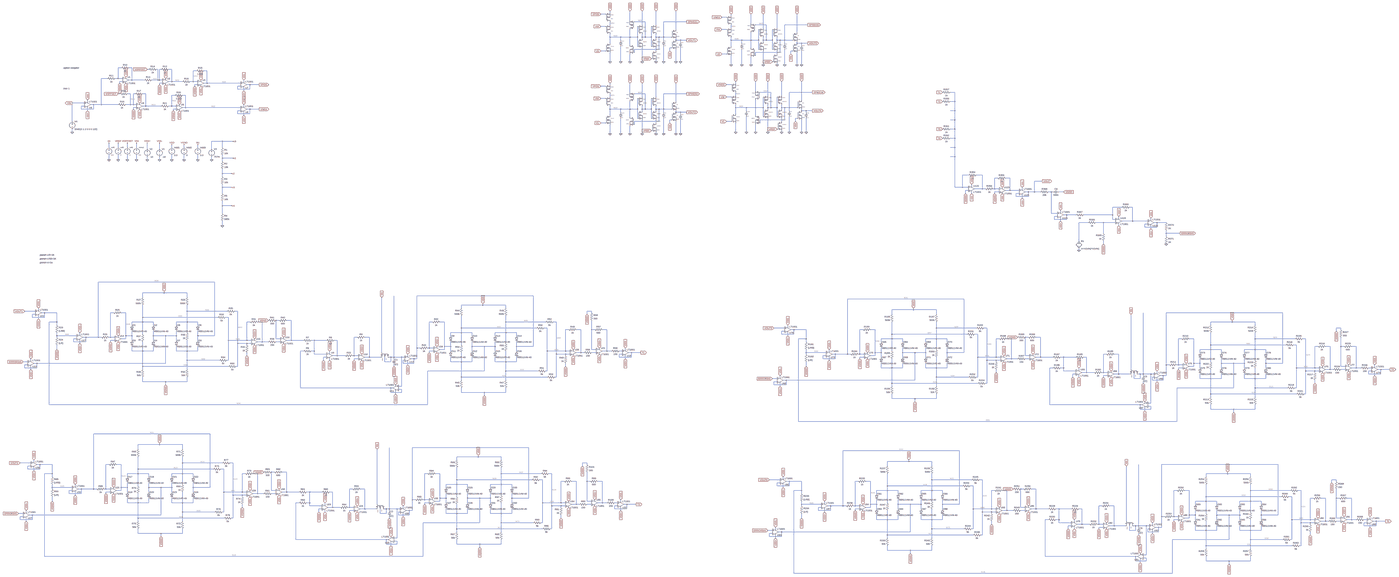
[diagram p0: schematic OZ_4_bounded_curves.asc, whole sheet]
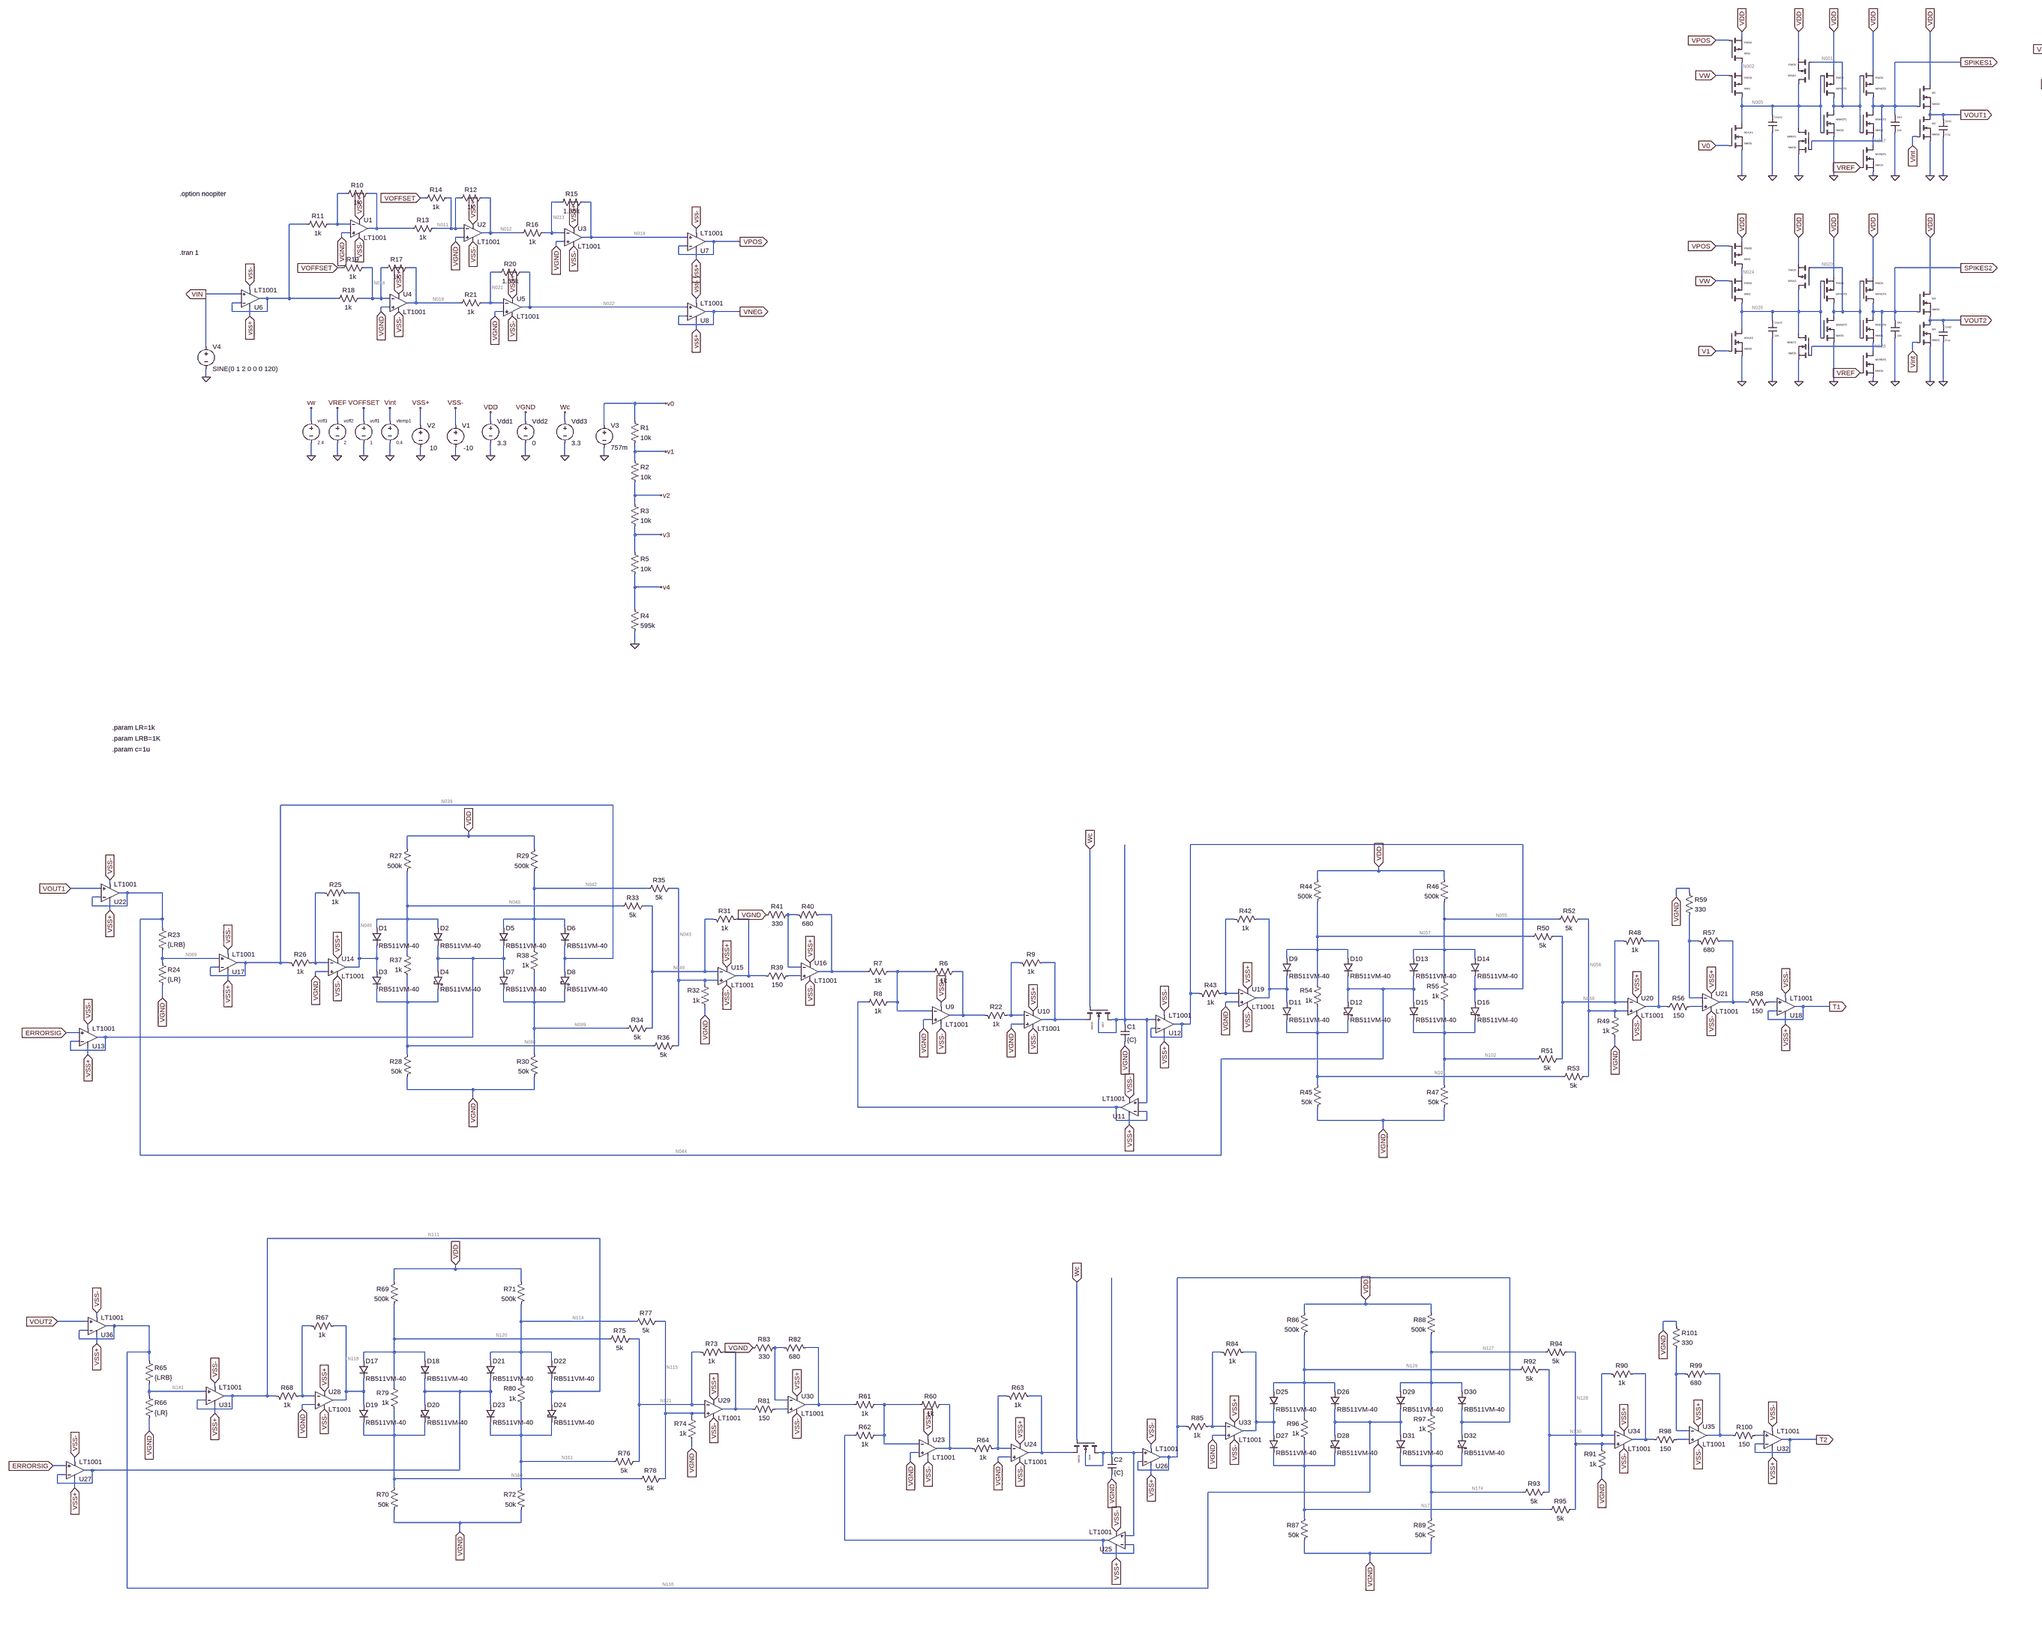
[diagram p1: schematic OZ_4_bounded_curves.asc, part, row 1 of 1, column 1 of 2]
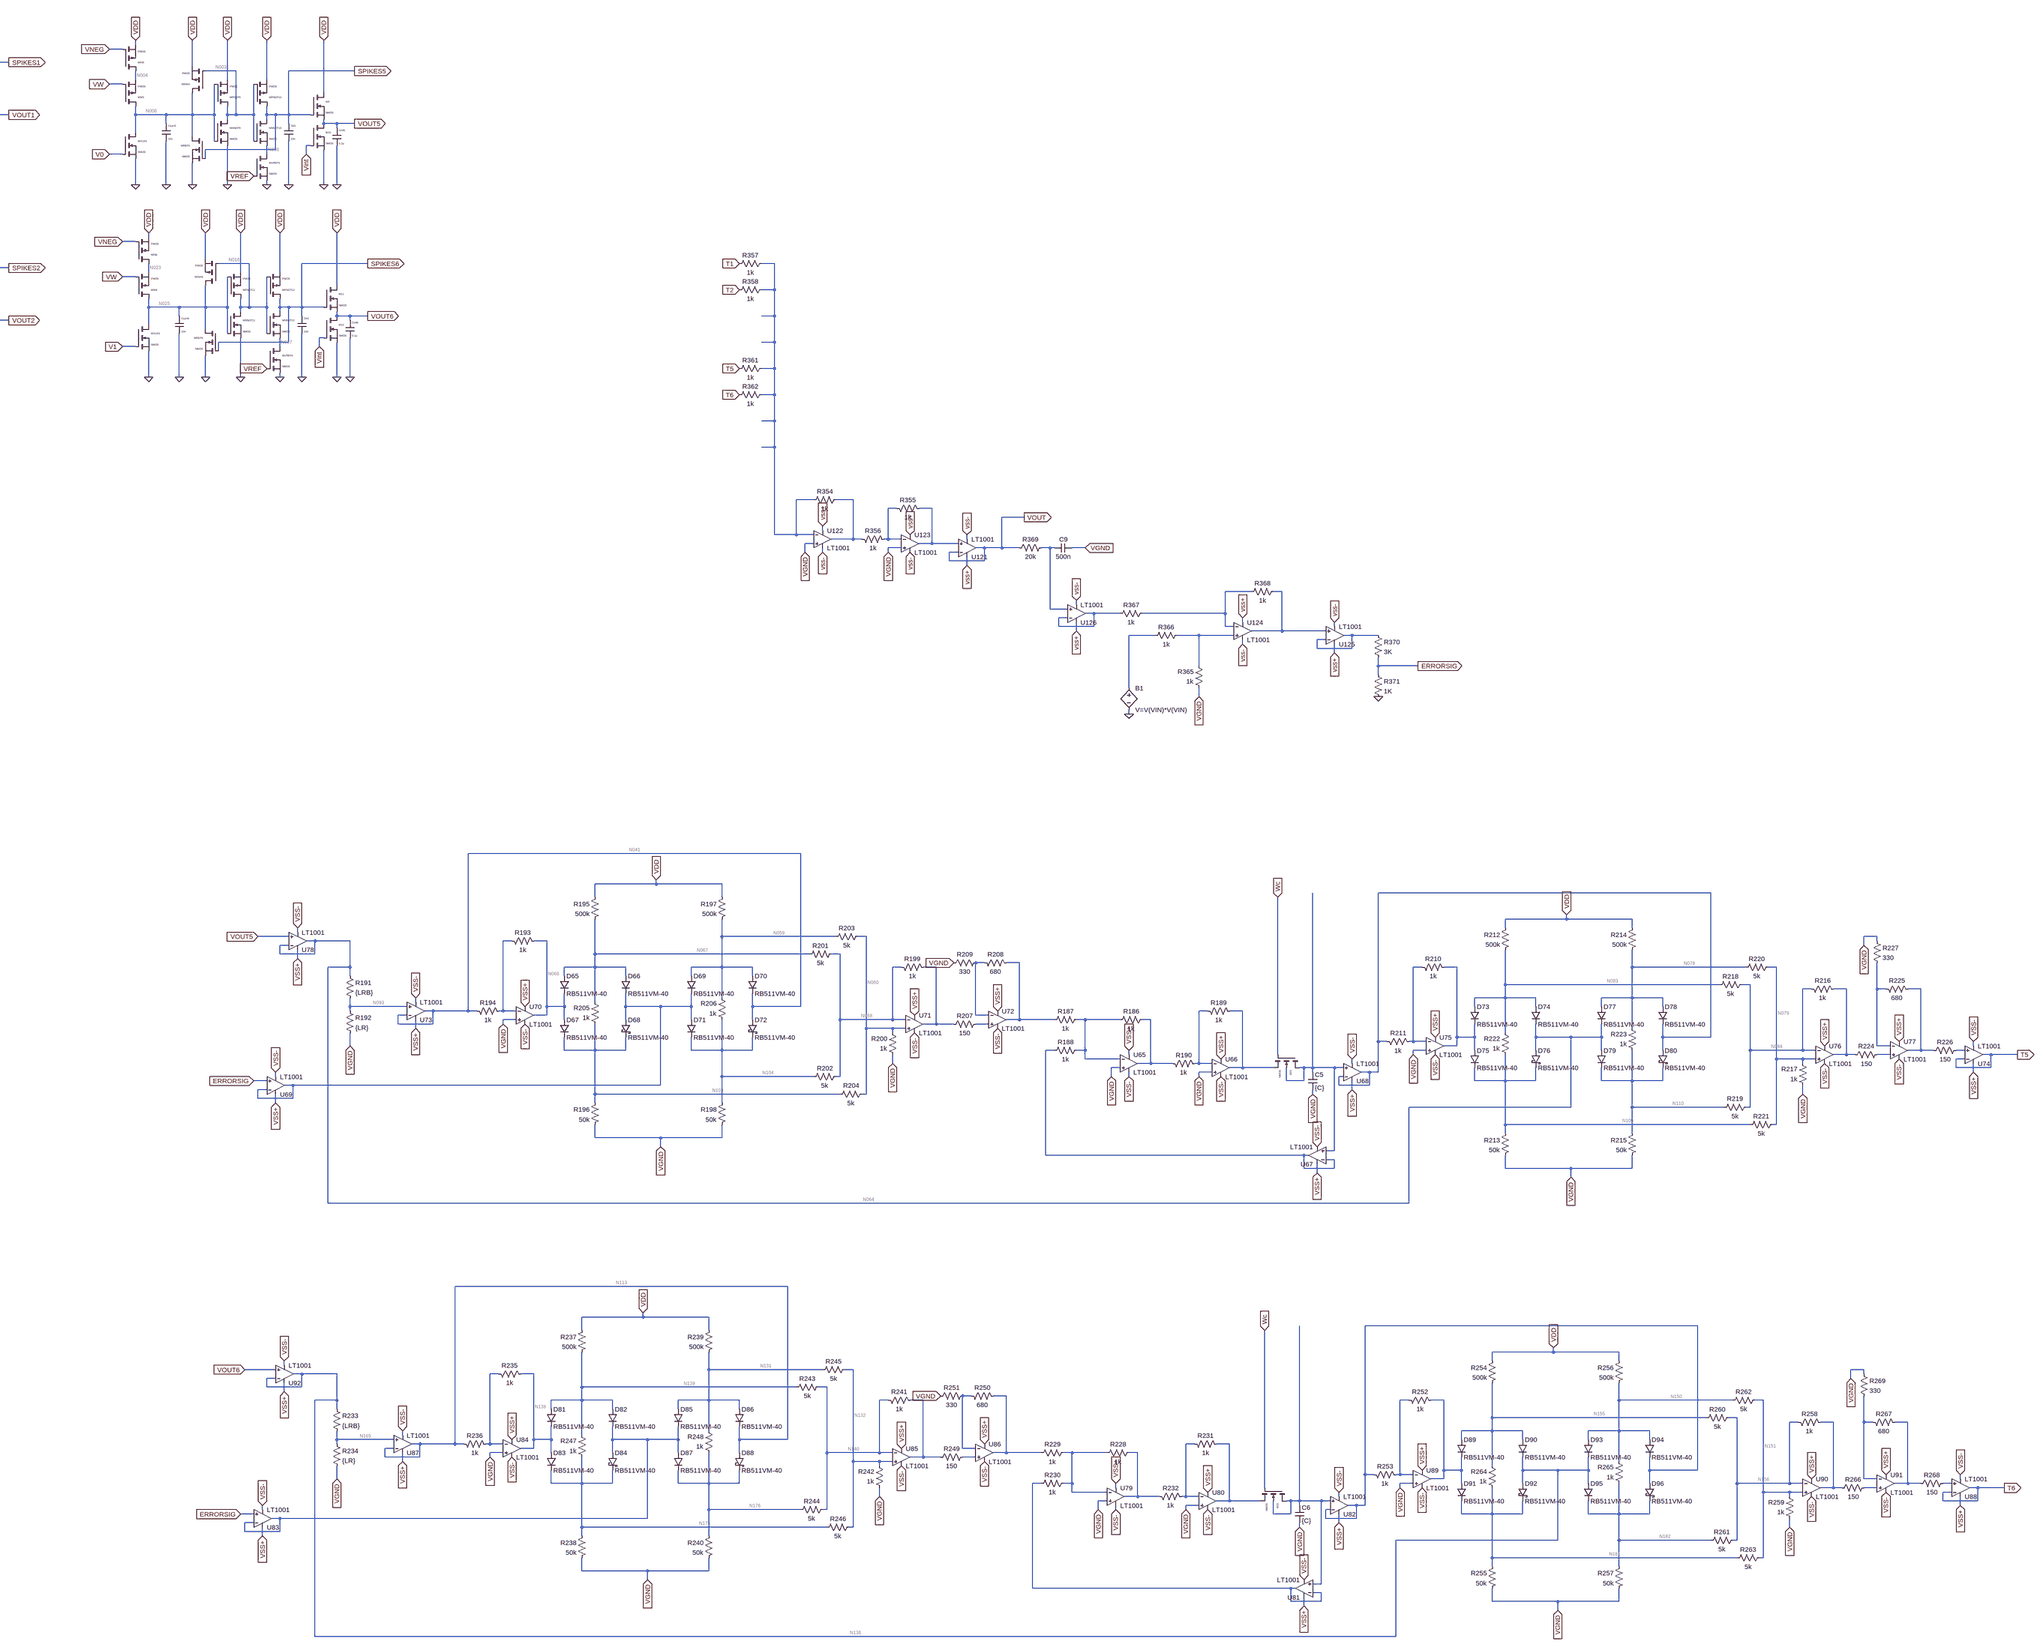
[diagram p2: schematic OZ_4_bounded_curves.asc, part, row 1 of 1, column 2 of 2]
* OZ_4_bounded_curves.asc
vtemp1 Vint 0 0.4
Vdd1 VDD 0 3.3
V1 VSS- 0 -10
V2 VSS+ 0 10
voff1 VOFFSET 0 1
voff2 VREF 0 2
voff3 vw 0 2.4
Vdd2 VGND 0 0
XU1 VGND N009 VSS+ VSS- N010 LT1001  ; pins In+ In- V+ V- OUT
R10 N010 N009 1k
R11 N009 N015 1k
XU2 VGND N011 VSS+ VSS- N012 LT1001  ; pins In+ In- V+ V- OUT
R12 N012 N011 1k
R13 N011 N010 1k
R14 N011 VOFFSET 1k
XU3 VGND N013 VSS+ VSS- N014 LT1001  ; pins In+ In- V+ V- OUT
R15 N014 N013 1.65k
R16 N013 N012 1k
XU4 VGND N018 VSS+ VSS- N019 LT1001  ; pins In+ In- V+ V- OUT
R17 N019 N018 1k
R18 N018 N015 1k
R19 N018 VOFFSET 1k
XU5 VGND N021 VSS+ VSS- N022 LT1001  ; pins In+ In- V+ V- OUT
R20 N022 N021 1.65k
R21 N021 N019 1k
XU6 VIN N015 VSS+ VSS- N015 LT1001  ; pins In+ In- V+ V- OUT
XU7 N014 VPOS VSS+ VSS- VPOS LT1001  ; pins In+ In- V+ V- OUT
XU8 N022 VNEG VSS+ VSS- VNEG LT1001  ; pins In+ In- V+ V- OUT
MW1 N005 vw N002 N002 PMOS
Csyn1 N005 0 10n V=4 Irms=162m Rser=0.395426 Lser=0 mfg="KEMET" pn="C0402C103K7PAC" type="X5R" IC=0
Ck1 SPIKES1 0 10n
MPNOT1 N001 N005 VDD VDD PMOS
MNNOT1 N001 N005 0 0 NMOS
MVREF1 N007 VREF 0 0 NMOS
MREF1 N005 SPIKES1 0 0 NMOS
MVLK1 N005 V0 0 0 NMOS
MINA1 N005 N001 VDD VDD PMOS
MIN1 N002 VPOS VDD VDD PMOS
MPNOT2 SPIKES1 N001 VDD VDD PMOS
MNNOT2 SPIKES1 N001 N007 N007 NMOS
M1 VDD SPIKES1 VOUT1 VOUT1 NMOS
M2 VOUT1 Vint 0 0 NMOS
Cint1 VOUT1 0 0.1µ
MW2 N026 vw N024 N024 PMOS
Csyn2 N026 0 10n V=4 Irms=162m Rser=0.395426 Lser=0 mfg="KEMET" pn="C0402C103K7PAC" type="X5R" IC=0
Ck2 SPIKES2 0 10n
MPNOT3 N020 N026 VDD VDD PMOS
MNNOT3 N020 N026 0 0 NMOS
MVREF2 N028 VREF 0 0 NMOS
MREF2 N026 SPIKES2 0 0 NMOS
MVLK2 N026 V1 0 0 NMOS
MINA2 N026 N020 VDD VDD PMOS
MIN2 N024 VPOS VDD VDD PMOS
MPNOT4 SPIKES2 N020 VDD VDD PMOS
MNNOT4 SPIKES2 N020 N028 N028 NMOS
M3 VDD SPIKES2 VOUT2 VOUT2 NMOS
M4 VOUT2 Vint 0 0 NMOS
Cint2 VOUT2 0 0.1µ
MW5 N006 vw N004 N004 PMOS
Csyn5 N006 0 10n V=4 Irms=162m Rser=0.395426 Lser=0 mfg="KEMET" pn="C0402C103K7PAC" type="X5R" IC=0
Ck5 SPIKES5 0 10n
MPNOT9 N003 N006 VDD VDD PMOS
MNNOT9 N003 N006 0 0 NMOS
MVREF5 N008 VREF 0 0 NMOS
MREF5 N006 SPIKES5 0 0 NMOS
MVLK5 N006 V0 0 0 NMOS
MINA5 N006 N003 VDD VDD PMOS
MIN5 N004 VNEG VDD VDD PMOS
MPNOT10 SPIKES5 N003 VDD VDD PMOS
MNNOT10 SPIKES5 N003 N008 N008 NMOS
M9 VDD SPIKES5 VOUT5 VOUT5 NMOS
M10 VOUT5 Vint 0 0 NMOS
Cint5 VOUT5 0 0.1µ
MW6 N025 vw N023 N023 PMOS
Csyn6 N025 0 10n V=4 Irms=162m Rser=0.395426 Lser=0 mfg="KEMET" pn="C0402C103K7PAC" type="X5R" IC=0
Ck6 SPIKES6 0 10n
MPNOT11 N016 N025 VDD VDD PMOS
MNNOT11 N016 N025 0 0 NMOS
MVREF6 N027 VREF 0 0 NMOS
MREF6 N025 SPIKES6 0 0 NMOS
MVLK6 N025 V1 0 0 NMOS
MINA6 N025 N016 VDD VDD PMOS
MIN6 N023 VNEG VDD VDD PMOS
MPNOT12 SPIKES6 N016 VDD VDD PMOS
MNNOT12 SPIKES6 N016 N027 N027 NMOS
M11 VDD SPIKES6 VOUT6 VOUT6 NMOS
M12 VOUT6 Vint 0 0 NMOS
Cint6 VOUT6 0 0.1µ
V3 V0 0 757m
R1 V0 V1 10k
R2 V1 v2 10k
R3 v2 v3 10k
R4 v4 0 595k
R5 v3 v4 10k
V4 VIN 0 SINE(0 1 2 0 0 0 120)
XU121 N031 VOUT VSS+ VSS- VOUT LT1001  ; pins In+ In- V+ V- OUT
XU122 VGND N017 VSS+ VSS- N029 LT1001  ; pins In+ In- V+ V- OUT
R354 N029 N017 1k
XU123 VGND N030 VSS+ VSS- N031 LT1001  ; pins In+ In- V+ V- OUT
R355 N030 N031 1k
R356 N029 N030 1k
R357 N017 T1 1k
R358 N017 T2 1k
R361 N017 T5 1k
R362 N017 T6 1k
M17 N097 Wc N072 N097 NMOS
C1 N097 VGND {C} IC=0
XU9 VGND N080 VSS+ VSS- N081 LT1001  ; pins In+ In- V+ V- OUT
R6 N081 N080 1k
R7 N080 N051 1k
R8 N080 N090 1k
XU10 VGND N071 VSS+ VSS- N072 LT1001  ; pins In+ In- V+ V- OUT
R9 N071 N072 1k
R22 N081 N071 1k
XU11 N097 N090 VSS+ VSS- N090 LT1001  ; pins In+ In- V+ V- OUT
XU12 N097 N040 VSS+ VSS- N040 LT1001  ; pins In+ In- V+ V- OUT
R23 N044 N069 {LRB}
R24 N069 VGND {LR}
XU13 ERRORSIG N070 VSS+ VSS- N070 LT1001  ; pins In+ In- V+ V- OUT
D1 N048 N046 RB511VM-40
XU14 VGND N045 VSS+ VSS- N046 LT1001  ; pins In+ In- V+ V- OUT
R25 N045 N046 1k
R26 N039 N045 1k
D2 N048 N070 RB511VM-40
D3 N046 N088 RB511VM-40
D4 N070 N088 RB511VM-40
R27 VDD N048 500k
R28 N088 VGND 50k
D5 N042 N070 RB511VM-40
D6 N042 N039 RB511VM-40
D7 N070 N089 RB511VM-40
D8 N039 N089 RB511VM-40
R29 VDD N042 500k
R30 N089 VGND 50k
XU15 N043 N049 VSS+ VSS- N052 LT1001  ; pins In+ In- V+ V- OUT
R31 N049 N052 1k
R32 VGND N043 1k
R33 N049 N048 5k
R34 N049 N089 5k
R35 N043 N042 5k
R36 N043 N088 5k
R37 N088 N048 1k
R38 N089 N042 1k
R39 N052 N082 150
XU16 N082 N050 VSS+ VSS- N051 LT1001  ; pins In+ In- V+ V- OUT
R40 N050 N051 680
R41 VGND N050 330
XU17 N069 N039 VSS+ VSS- N039 LT1001  ; pins In+ In- V+ V- OUT
XU18 N091 T1 VSS+ VSS- T1 LT1001  ; pins In+ In- V+ V- OUT
D9 N057 N054 RB511VM-40
XU19 VGND N053 VSS+ VSS- N054 LT1001  ; pins In+ In- V+ V- OUT
R42 N053 N054 1k
R43 N040 N053 1k
D10 N057 N044 RB511VM-40
D11 N054 N101 RB511VM-40
D12 N044 N101 RB511VM-40
R44 VDD N057 500k
R45 N101 VGND 50k
D13 N055 N044 RB511VM-40
D14 N055 N040 RB511VM-40
D15 N044 N102 RB511VM-40
D16 N040 N102 RB511VM-40
R46 VDD N055 500k
R47 N102 VGND 50k
XU20 N056 N058 VSS+ VSS- N061 LT1001  ; pins In+ In- V+ V- OUT
R48 N058 N061 1k
R49 VGND N056 1k
R50 N058 N057 5k
R51 N058 N102 5k
R52 N056 N055 5k
R53 N056 N101 5k
R54 N101 N057 1k
R55 N102 N055 1k
R56 N061 N092 150
XU21 N092 N062 VSS+ VSS- N063 LT1001  ; pins In+ In- V+ V- OUT
R57 N062 N063 680
R58 N063 N091 150
R59 VGND N062 330
XU22 VOUT1 N044 VSS+ VSS- N044 LT1001  ; pins In+ In- V+ V- OUT
M18 N169 Wc N144 N169 NMOS
C2 N169 VGND {C} IC=0
XU23 VGND N152 VSS+ VSS- N153 LT1001  ; pins In+ In- V+ V- OUT
R60 N153 N152 1k
R61 N152 N123 1k
R62 N152 N162 1k
XU24 VGND N143 VSS+ VSS- N144 LT1001  ; pins In+ In- V+ V- OUT
R63 N143 N144 1k
R64 N153 N143 1k
XU25 N169 N162 VSS+ VSS- N162 LT1001  ; pins In+ In- V+ V- OUT
XU26 N169 N112 VSS+ VSS- N112 LT1001  ; pins In+ In- V+ V- OUT
R65 N116 N141 {LRB}
R66 N141 VGND {LR}
XU27 ERRORSIG N142 VSS+ VSS- N142 LT1001  ; pins In+ In- V+ V- OUT
D17 N120 N118 RB511VM-40
XU28 VGND N117 VSS+ VSS- N118 LT1001  ; pins In+ In- V+ V- OUT
R67 N117 N118 1k
R68 N111 N117 1k
D18 N120 N142 RB511VM-40
D19 N118 N160 RB511VM-40
D20 N142 N160 RB511VM-40
R69 VDD N120 500k
R70 N160 VGND 50k
D21 N114 N142 RB511VM-40
D22 N114 N111 RB511VM-40
D23 N142 N161 RB511VM-40
D24 N111 N161 RB511VM-40
R71 VDD N114 500k
R72 N161 VGND 50k
XU29 N115 N121 VSS+ VSS- N124 LT1001  ; pins In+ In- V+ V- OUT
R73 N121 N124 1k
R74 VGND N115 1k
R75 N121 N120 5k
R76 N121 N161 5k
R77 N115 N114 5k
R78 N115 N160 5k
R79 N160 N120 1k
R80 N161 N114 1k
R81 N124 N154 150
XU30 N154 N122 VSS+ VSS- N123 LT1001  ; pins In+ In- V+ V- OUT
R82 N122 N123 680
R83 VGND N122 330
XU31 N141 N111 VSS+ VSS- N111 LT1001  ; pins In+ In- V+ V- OUT
XU32 N163 T2 VSS+ VSS- T2 LT1001  ; pins In+ In- V+ V- OUT
D25 N129 N126 RB511VM-40
XU33 VGND N125 VSS+ VSS- N126 LT1001  ; pins In+ In- V+ V- OUT
R84 N125 N126 1k
R85 N112 N125 1k
D26 N129 N116 RB511VM-40
D27 N126 N173 RB511VM-40
D28 N116 N173 RB511VM-40
R86 VDD N129 500k
R87 N173 VGND 50k
D29 N127 N116 RB511VM-40
D30 N127 N112 RB511VM-40
D31 N116 N174 RB511VM-40
D32 N112 N174 RB511VM-40
R88 VDD N127 500k
R89 N174 VGND 50k
XU34 N128 N130 VSS+ VSS- N133 LT1001  ; pins In+ In- V+ V- OUT
R90 N130 N133 1k
R91 VGND N128 1k
R92 N130 N129 5k
R93 N130 N174 5k
R94 N128 N127 5k
R95 N128 N173 5k
R96 N173 N129 1k
R97 N174 N127 1k
R98 N133 N164 150
XU35 N164 N134 VSS+ VSS- N135 LT1001  ; pins In+ In- V+ V- OUT
R99 N134 N135 680
R100 N135 N163 150
R101 VGND N134 330
XU36 VOUT2 N116 VSS+ VSS- N116 LT1001  ; pins In+ In- V+ V- OUT
M21 N108 Wc N096 N108 NMOS
C5 N108 VGND {C} IC=0
XU65 VGND N098 VSS+ VSS- N099 LT1001  ; pins In+ In- V+ V- OUT
R186 N099 N098 1k
R187 N098 N074 1k
R188 N098 N105 1k
XU66 VGND N095 VSS+ VSS- N096 LT1001  ; pins In+ In- V+ V- OUT
R189 N095 N096 1k
R190 N099 N095 1k
XU67 N108 N105 VSS+ VSS- N105 LT1001  ; pins In+ In- V+ V- OUT
XU68 N108 N047 VSS+ VSS- N047 LT1001  ; pins In+ In- V+ V- OUT
R191 N064 N093 {LRB}
R192 N093 VGND {LR}
XU69 ERRORSIG N094 VSS+ VSS- N094 LT1001  ; pins In+ In- V+ V- OUT
D65 N067 N066 RB511VM-40
XU70 VGND N065 VSS+ VSS- N066 LT1001  ; pins In+ In- V+ V- OUT
R193 N065 N066 1k
R194 N041 N065 1k
D66 N067 N094 RB511VM-40
D67 N066 N103 RB511VM-40
D68 N094 N103 RB511VM-40
R195 VDD N067 500k
R196 N103 VGND 50k
D69 N059 N094 RB511VM-40
D70 N059 N041 RB511VM-40
D71 N094 N104 RB511VM-40
D72 N041 N104 RB511VM-40
R197 VDD N059 500k
R198 N104 VGND 50k
XU71 N060 N068 VSS+ VSS- N075 LT1001  ; pins In+ In- V+ V- OUT
R199 N068 N075 1k
R200 VGND N060 1k
R201 N068 N067 5k
R202 N068 N104 5k
R203 N060 N059 5k
R204 N060 N103 5k
R205 N103 N067 1k
R206 N104 N059 1k
R207 N075 N100 150
XU72 N100 N073 VSS+ VSS- N074 LT1001  ; pins In+ In- V+ V- OUT
R208 N073 N074 680
R209 VGND N073 330
XU73 N093 N041 VSS+ VSS- N041 LT1001  ; pins In+ In- V+ V- OUT
XU74 N106 T5 VSS+ VSS- T5 LT1001  ; pins In+ In- V+ V- OUT
D73 N083 N077 RB511VM-40
XU75 VGND N076 VSS+ VSS- N077 LT1001  ; pins In+ In- V+ V- OUT
R210 N076 N077 1k
R211 N047 N076 1k
D74 N083 N064 RB511VM-40
D75 N077 N109 RB511VM-40
D76 N064 N109 RB511VM-40
R212 VDD N083 500k
R213 N109 VGND 50k
D77 N078 N064 RB511VM-40
D78 N078 N047 RB511VM-40
D79 N064 N110 RB511VM-40
D80 N047 N110 RB511VM-40
R214 VDD N078 500k
R215 N110 VGND 50k
XU76 N079 N084 VSS+ VSS- N085 LT1001  ; pins In+ In- V+ V- OUT
R216 N084 N085 1k
R217 VGND N079 1k
R218 N084 N083 5k
R219 N084 N110 5k
R220 N079 N078 5k
R221 N079 N109 5k
R222 N109 N083 1k
R223 N110 N078 1k
R224 N085 N107 150
XU77 N107 N086 VSS+ VSS- N087 LT1001  ; pins In+ In- V+ V- OUT
R225 N086 N087 680
R226 N087 N106 150
R227 VGND N086 330
XU78 VOUT5 N064 VSS+ VSS- N064 LT1001  ; pins In+ In- V+ V- OUT
M22 N180 Wc N168 N180 NMOS
C6 N180 VGND {C} IC=0
XU79 VGND N170 VSS+ VSS- N171 LT1001  ; pins In+ In- V+ V- OUT
R228 N171 N170 1k
R229 N170 N146 1k
R230 N170 N177 1k
XU80 VGND N167 VSS+ VSS- N168 LT1001  ; pins In+ In- V+ V- OUT
R231 N167 N168 1k
R232 N171 N167 1k
XU81 N180 N177 VSS+ VSS- N177 LT1001  ; pins In+ In- V+ V- OUT
XU82 N180 N119 VSS+ VSS- N119 LT1001  ; pins In+ In- V+ V- OUT
R233 N136 N165 {LRB}
R234 N165 VGND {LR}
XU83 ERRORSIG N166 VSS+ VSS- N166 LT1001  ; pins In+ In- V+ V- OUT
D81 N139 N138 RB511VM-40
XU84 VGND N137 VSS+ VSS- N138 LT1001  ; pins In+ In- V+ V- OUT
R235 N137 N138 1k
R236 N113 N137 1k
D82 N139 N166 RB511VM-40
D83 N138 N175 RB511VM-40
D84 N166 N175 RB511VM-40
R237 VDD N139 500k
R238 N175 VGND 50k
D85 N131 N166 RB511VM-40
D86 N131 N113 RB511VM-40
D87 N166 N176 RB511VM-40
D88 N113 N176 RB511VM-40
R239 VDD N131 500k
R240 N176 VGND 50k
XU85 N132 N140 VSS+ VSS- N147 LT1001  ; pins In+ In- V+ V- OUT
R241 N140 N147 1k
R242 VGND N132 1k
R243 N140 N139 5k
R244 N140 N176 5k
R245 N132 N131 5k
R246 N132 N175 5k
R247 N175 N139 1k
R248 N176 N131 1k
R249 N147 N172 150
XU86 N172 N145 VSS+ VSS- N146 LT1001  ; pins In+ In- V+ V- OUT
R250 N145 N146 680
R251 VGND N145 330
XU87 N165 N113 VSS+ VSS- N113 LT1001  ; pins In+ In- V+ V- OUT
XU88 N178 T6 VSS+ VSS- T6 LT1001  ; pins In+ In- V+ V- OUT
D89 N155 N149 RB511VM-40
XU89 VGND N148 VSS+ VSS- N149 LT1001  ; pins In+ In- V+ V- OUT
R252 N148 N149 1k
R253 N119 N148 1k
D90 N155 N136 RB511VM-40
D91 N149 N181 RB511VM-40
D92 N136 N181 RB511VM-40
R254 VDD N155 500k
R255 N181 VGND 50k
D93 N150 N136 RB511VM-40
D94 N150 N119 RB511VM-40
D95 N136 N182 RB511VM-40
D96 N119 N182 RB511VM-40
R256 VDD N150 500k
R257 N182 VGND 50k
XU90 N151 N156 VSS+ VSS- N157 LT1001  ; pins In+ In- V+ V- OUT
R258 N156 N157 1k
R259 VGND N151 1k
R260 N156 N155 5k
R261 N156 N182 5k
R262 N151 N150 5k
R263 N151 N181 5k
R264 N181 N155 1k
R265 N182 N150 1k
R266 N157 N179 150
XU91 N179 N158 VSS+ VSS- N159 LT1001  ; pins In+ In- V+ V- OUT
R267 N158 N159 680
R268 N159 N178 150
R269 VGND N158 330
XU92 VOUT6 N136 VSS+ VSS- N136 LT1001  ; pins In+ In- V+ V- OUT
XU124 N037 N033 VSS+ VSS- N034 LT1001  ; pins In+ In- V+ V- OUT
R365 VGND N037 1k
R366 N037 N036 1k
R367 N033 N035 1k
R368 N034 N033 1k
XU125 N034 N038 VSS+ VSS- N038 LT1001  ; pins In+ In- V+ V- OUT
R369 VOUT N032 20k
C9 N032 VGND 500n
XU126 N032 N035 VSS+ VSS- N035 LT1001  ; pins In+ In- V+ V- OUT
R370 N038 ERRORSIG 3K
R371 ERRORSIG 0 1K
Vdd3 Wc 0 3.3
B1 N036 0 V=V(VIN)*V(VIN)
.model D D
.lib standard.dio
.model NMOS NMOS
.model PMOS PMOS
.lib standard.mos
.tran 1
.option noopiter
.param LR=1k
.param LRB=1K
.param c=1u
.lib LTC.lib
.backanno
.end

* Results of the author's LTspice run, read from the files saved beside the schematic
* Operating Point, zero values left out:
*   V(vint) = 400 mV
*   V(vdd) = 3.3 V
*   V(vss-) = -10 V
*   V(vss+) = 10 V
*   V(voffset) = 1 V
*   V(vref) = 2 V
*   V(vw) = 2.4 V
*   V(n011) = 1.43 µV
*   V(n012) = -1 V
*   V(n013) = -2.256 µV
*   V(n014) = 1.65 V
*   V(n018) = 1.43 µV
*   V(n019) = -1 V
*   V(n021) = -2.256 µV
*   V(n022) = 1.65 V
*   V(vpos) = 1.65 V
*   V(vneg) = 1.65 V
*   V(n005) = 2.106 µV
*   V(n002) = 3.13 V
*   V(spikes1) = 265.4 nV
*   V(n001) = 3.3 V
*   V(n007) = 165.2 nV
*   V(v0) = 757 mV
*   V(vout1) = 826.3 nV
*   V(n026) = 2.106 µV
*   V(n024) = 3.13 V
*   V(spikes2) = 265.4 nV
*   V(n020) = 3.3 V
*   V(n028) = 165.2 nV
*   V(v1) = 745.1 mV
*   V(vout2) = 826.3 nV
*   V(n006) = 2.106 µV
*   V(n004) = 3.13 V
*   V(spikes5) = 265.4 nV
*   V(n003) = 3.3 V
*   V(n008) = 165.2 nV
*   V(vout5) = 826.3 nV
*   V(n025) = 2.106 µV
*   V(n023) = 3.13 V
*   V(spikes6) = 265.4 nV
*   V(n016) = 3.3 V
*   V(n027) = 165.2 nV
*   V(vout6) = 826.3 nV
*   V(v2) = 733.2 mV
*   V(v3) = 721.2 mV
*   V(v4) = 709.3 mV
*   V(wc) = 3.3 V
*   V(n044) = 826.3 nV
*   V(n069) = 413.2 nV
*   V(n048) = 19.24 mV
*   V(n046) = -413.1 nV
*   V(n039) = 413.2 nV
*   V(n088) = 16.29 mV
*   V(n042) = 19.24 mV
*   V(n089) = 16.29 mV
*   V(n049) = 5.076 mV
*   V(n043) = 5.076 mV
*   V(n057) = 19.24 mV
*   V(n101) = 16.29 mV
*   V(n055) = 19.24 mV
*   V(n102) = 16.29 mV
*   V(n058) = 5.076 mV
*   V(n056) = 5.076 mV
*   V(n116) = 826.3 nV
*   V(n141) = 413.2 nV
*   V(n120) = 19.24 mV
*   V(n118) = -413.1 nV
*   V(n111) = 413.2 nV
*   V(n160) = 16.29 mV
*   V(n114) = 19.24 mV
*   V(n161) = 16.29 mV
*   V(n121) = 5.076 mV
*   V(n115) = 5.076 mV
*   V(n129) = 19.24 mV
*   V(n173) = 16.29 mV
*   V(n127) = 19.24 mV
*   V(n174) = 16.29 mV
*   V(n130) = 5.076 mV
*   V(n128) = 5.076 mV
*   V(n064) = 826.3 nV
*   V(n093) = 413.2 nV
*   V(n067) = 19.24 mV
*   V(n066) = -413.1 nV
*   V(n041) = 413.2 nV
*   V(n103) = 16.29 mV
*   V(n059) = 19.24 mV
*   V(n104) = 16.29 mV
*   V(n068) = 5.076 mV
*   V(n060) = 5.076 mV
*   V(n083) = 19.24 mV
*   V(n109) = 16.29 mV
*   V(n078) = 19.24 mV
*   V(n110) = 16.29 mV
*   V(n084) = 5.076 mV
*   V(n079) = 5.076 mV
*   V(n136) = 826.3 nV
*   V(n165) = 413.2 nV
*   V(n139) = 19.24 mV
*   V(n138) = -413.1 nV
*   V(n113) = 413.2 nV
*   V(n175) = 16.29 mV
*   V(n131) = 19.24 mV
*   V(n176) = 16.29 mV
*   V(n140) = 5.076 mV
*   V(n132) = 5.076 mV
*   V(n155) = 19.24 mV
*   V(n181) = 16.29 mV
*   V(n150) = 19.24 mV
*   V(n182) = 16.29 mV
*   V(n156) = 5.076 mV
*   V(n151) = 5.076 mV
*   Id(M12) = 6.61 pA
*   Is(M12) = -6.61 pA
*   Id(M11) = 6.61 pA
*   Ib(M11) = -3.31 pA
*   Is(M11) = -3.3 pA
*   Id(Mnnot12) = 6.61 pA
*   Is(Mnnot12) = -6.61 pA
*   Id(Mvlk6) = 31.39 pA
*   Is(Mvlk6) = -31.39 pA
*   Id(Mvref6) = 6.61 pA
*   Is(Mvref6) = -6.61 pA
*   Id(Mnnot11) = 6.61 pA
*   Ib(Mnnot11) = -3.31 pA
*   Is(Mnnot11) = -3.3 pA
*   Id(M10) = 6.61 pA
*   Is(M10) = -6.61 pA
*   Id(M9) = 6.61 pA
*   Ib(M9) = -3.31 pA
*   Is(M9) = -3.3 pA
*   Id(Mnnot10) = 6.61 pA
*   Is(Mnnot10) = -6.61 pA
*   Id(Mvlk5) = 31.89 pA
*   Is(Mvlk5) = -31.89 pA
*   Id(Mvref5) = 6.61 pA
*   Is(Mvref5) = -6.61 pA
*   Id(Mnnot9) = 6.61 pA
*   Ib(Mnnot9) = -3.31 pA
*   Is(Mnnot9) = -3.3 pA
*   Id(M4) = 6.61 pA
*   Is(M4) = -6.61 pA
*   Id(M3) = 6.61 pA
*   Ib(M3) = -3.31 pA
*   Is(M3) = -3.3 pA
*   Id(Mnnot4) = 6.61 pA
*   Is(Mnnot4) = -6.61 pA
*   Id(Mvlk2) = 31.39 pA
*   Is(Mvlk2) = -31.39 pA
*   Id(Mvref2) = 6.61 pA
*   Is(Mvref2) = -6.61 pA
*   Id(Mnnot3) = 6.61 pA
*   Ib(Mnnot3) = -3.31 pA
*   Is(Mnnot3) = -3.3 pA
*   Id(M2) = 6.61 pA
*   Is(M2) = -6.61 pA
*   Id(M1) = 6.61 pA
*   Ib(M1) = -3.31 pA
*   Is(M1) = -3.3 pA
*   Id(Mnnot2) = 6.61 pA
*   Is(Mnnot2) = -6.61 pA
*   Id(Mvlk1) = 31.89 pA
*   Is(Mvlk1) = -31.89 pA
*   Id(Mvref1) = 6.61 pA
*   Is(Mvref1) = -6.61 pA
*   Id(Mnnot1) = 6.61 pA
*   Ib(Mnnot1) = -3.31 pA
*   Is(Mnnot1) = -3.3 pA
*   Id(Mpnot12) = -6.61 pA
*   Ib(Mpnot12) = 3.31 pA
*   Is(Mpnot12) = 3.3 pA
*   Id(Min6) = -5.326 µA
*   Is(Min6) = 5.326 µA
*   Id(Mina6) = -6.61 pA
*   Ib(Mina6) = 3.31 pA
*   Is(Mina6) = 3.3 pA
*   Id(Mpnot11) = -6.61 pA
*   Is(Mpnot11) = 6.61 pA
*   Id(Mw6) = -5.326 µA
*   Ib(Mw6) = 3.14 pA
*   Is(Mw6) = 5.326 µA
*   Id(Mpnot10) = -6.61 pA
*   Ib(Mpnot10) = 3.31 pA
*   Is(Mpnot10) = 3.3 pA
*   Id(Min5) = -5.326 µA
*   Is(Min5) = 5.326 µA
*   Id(Mina5) = -6.61 pA
*   Ib(Mina5) = 3.31 pA
*   Is(Mina5) = 3.3 pA
*   Id(Mpnot9) = -6.61 pA
*   Is(Mpnot9) = 6.61 pA
*   Id(Mw5) = -5.326 µA
*   Ib(Mw5) = 3.14 pA
*   Is(Mw5) = 5.326 µA
*   Id(Mpnot4) = -6.61 pA
*   Ib(Mpnot4) = 3.31 pA
*   Is(Mpnot4) = 3.3 pA
*   Id(Min2) = -5.326 µA
*   Is(Min2) = 5.326 µA
*   Id(Mina2) = -6.61 pA
*   Ib(Mina2) = 3.31 pA
*   Is(Mina2) = 3.3 pA
*   Id(Mpnot3) = -6.61 pA
*   Is(Mpnot3) = 6.61 pA
*   Id(Mw2) = -5.326 µA
*   Ib(Mw2) = 3.14 pA
*   Is(Mw2) = 5.326 µA
*   Id(Mpnot2) = -6.61 pA
*   Ib(Mpnot2) = 3.31 pA
*   Is(Mpnot2) = 3.3 pA
*   Id(Min1) = -5.326 µA
*   Is(Min1) = 5.326 µA
*   Id(Mina1) = -6.61 pA
*   Ib(Mina1) = 3.31 pA
*   Is(Mina1) = 3.3 pA
*   Id(Mpnot1) = -6.61 pA
*   Is(Mpnot1) = 6.61 pA
*   Id(Mw1) = -5.326 µA
*   Ib(Mw1) = 3.14 pA
*   Is(Mw1) = 5.326 µA
*   I(Csyn6) = 5.326 µA
*   I(Csyn5) = 5.326 µA
*   I(Csyn2) = 5.326 µA
*   I(Csyn1) = 5.326 µA
*   I(D96) = -190.8 nA
*   I(D95) = -190.8 nA
*   I(D94) = 389 nA
*   I(D93) = 389 nA
*   I(D92) = -190.8 nA
*   I(D91) = -190.8 nA
*   I(D90) = 389 nA
*   I(D89) = 389 nA
*   I(D88) = -190.8 nA
*   I(D87) = -190.8 nA
*   I(D86) = 389 nA
*   I(D85) = 389 nA
*   I(D84) = -190.8 nA
*   I(D83) = -190.8 nA
*   I(D82) = 389 nA
*   I(D81) = 389 nA
*   I(D80) = -190.8 nA
*   I(D79) = -190.8 nA
*   I(D78) = 389 nA
*   I(D77) = 389 nA
*   I(D76) = -190.8 nA
*   I(D75) = -190.8 nA
*   I(D74) = 389 nA
*   I(D73) = 389 nA
*   I(D72) = -190.8 nA
*   I(D71) = -190.8 nA
*   I(D70) = 389 nA
*   I(D69) = 389 nA
*   I(D68) = -190.8 nA
*   I(D67) = -190.8 nA
*   I(D66) = 389 nA
*   I(D65) = 389 nA
*   I(D32) = -190.8 nA
*   I(D31) = -190.8 nA
*   I(D30) = 389 nA
*   I(D29) = 389 nA
*   I(D28) = -190.8 nA
*   I(D27) = -190.8 nA
*   I(D26) = 389 nA
*   I(D25) = 389 nA
*   I(D24) = -190.8 nA
*   I(D23) = -190.8 nA
*   I(D22) = 389 nA
*   I(D21) = 389 nA
*   I(D20) = -190.8 nA
*   I(D19) = -190.8 nA
*   I(D18) = 389 nA
*   I(D17) = 389 nA
*   I(D16) = -190.8 nA
*   I(D15) = -190.8 nA
*   I(D14) = 389 nA
*   I(D13) = 389 nA
*   I(D12) = -190.8 nA
*   I(D11) = -190.8 nA
*   I(D10) = 389 nA
*   I(D9) = 389 nA
*   I(D8) = -190.8 nA
*   I(D7) = -190.8 nA
*   I(D6) = 389 nA
*   I(D5) = 389 nA
*   I(D4) = -190.8 nA
*   I(D3) = -190.8 nA
*   I(D2) = 389 nA
*   I(D1) = 389 nA
*   I(R368) = -3.806 pA
*   I(R367) = -3.806 pA
*   I(R265) = -2.95 µA
*   I(R264) = -2.95 µA
*   I(R263) = -2.243 µA
*   I(R262) = -2.833 µA
*   I(R261) = -2.243 µA
*   I(R260) = -2.833 µA
*   I(R259) = -5.076 µA
*   I(R258) = 5.076 µA
*   I(R257) = 325.8 nA
*   I(R256) = 6.562 µA
*   I(R255) = 325.8 nA
*   I(R254) = 6.562 µA
*   I(R251) = -4.61 pA
*   I(R250) = -4.61 pA
*   I(R248) = -2.95 µA
*   I(R247) = -2.95 µA
*   I(R246) = -2.243 µA
*   I(R245) = -2.833 µA
*   I(R244) = -2.243 µA
*   I(R243) = -2.833 µA
*   I(R242) = -5.076 µA
*   I(R241) = 5.076 µA
*   I(R240) = 325.8 nA
*   I(R239) = 6.562 µA
*   I(R238) = 325.8 nA
*   I(R237) = 6.562 µA
*   I(R236) = 413.1 pA
*   I(R235) = 413.1 pA
*   I(R234) = 413.2 pA
*   I(R233) = 413.2 pA
*   I(R232) = -4.656 pA
*   I(R231) = -4.656 pA
*   I(R229) = -4.656 pA
*   I(R228) = -4.656 pA
*   I(R223) = -2.95 µA
*   I(R222) = -2.95 µA
*   I(R221) = -2.243 µA
*   I(R220) = -2.833 µA
*   I(R219) = -2.243 µA
*   I(R218) = -2.833 µA
*   I(R217) = -5.076 µA
*   I(R216) = 5.076 µA
*   I(R215) = 325.8 nA
*   I(R214) = 6.562 µA
*   I(R213) = 325.8 nA
*   I(R212) = 6.562 µA
*   I(R209) = -4.61 pA
*   I(R208) = -4.61 pA
*   I(R206) = -2.95 µA
*   I(R205) = -2.95 µA
*   I(R204) = -2.243 µA
*   I(R203) = -2.833 µA
*   I(R202) = -2.243 µA
*   I(R201) = -2.833 µA
*   I(R200) = -5.076 µA
*   I(R199) = 5.076 µA
*   I(R198) = 325.8 nA
*   I(R197) = 6.562 µA
*   I(R196) = 325.8 nA
*   I(R195) = 6.562 µA
*   I(R194) = 413.1 pA
*   I(R193) = 413.1 pA
*   I(R192) = 413.2 pA
*   I(R191) = 413.2 pA
*   I(R190) = -4.656 pA
*   I(R189) = -4.656 pA
*   I(R187) = -4.656 pA
*   I(R186) = -4.656 pA
*   I(R97) = -2.95 µA
*   I(R96) = -2.95 µA
*   I(R95) = -2.243 µA
*   I(R94) = -2.833 µA
*   I(R93) = -2.243 µA
*   I(R92) = -2.833 µA
*   I(R91) = -5.076 µA
*   I(R90) = 5.076 µA
*   I(R89) = 325.8 nA
*   I(R88) = 6.562 µA
*   I(R87) = 325.8 nA
*   I(R86) = 6.562 µA
*   I(R83) = -4.61 pA
*   I(R82) = -4.61 pA
*   I(R80) = -2.95 µA
*   I(R79) = -2.95 µA
*   I(R78) = -2.243 µA
*   I(R77) = -2.833 µA
*   I(R76) = -2.243 µA
*   I(R75) = -2.833 µA
*   I(R74) = -5.076 µA
*   I(R73) = 5.076 µA
*   I(R72) = 325.8 nA
*   I(R71) = 6.562 µA
*   I(R70) = 325.8 nA
*   I(R69) = 6.562 µA
*   I(R68) = 413.1 pA
*   I(R67) = 413.1 pA
*   I(R66) = 413.2 pA
*   I(R65) = 413.2 pA
*   I(R64) = -4.656 pA
*   I(R63) = -4.656 pA
*   I(R61) = -4.656 pA
*   I(R60) = -4.656 pA
*   I(R55) = -2.95 µA
*   I(R54) = -2.95 µA
*   I(R53) = -2.243 µA
*   I(R52) = -2.833 µA
*   I(R51) = -2.243 µA
*   I(R50) = -2.833 µA
*   I(R49) = -5.076 µA
*   I(R48) = 5.076 µA
*   I(R47) = 325.8 nA
*   I(R46) = 6.562 µA
*   I(R45) = 325.8 nA
*   I(R44) = 6.562 µA
*   I(R41) = -4.61 pA
*   I(R40) = -4.61 pA
*   I(R38) = -2.95 µA
*   I(R37) = -2.95 µA
*   I(R36) = -2.243 µA
*   I(R35) = -2.833 µA
*   I(R34) = -2.243 µA
*   I(R33) = -2.833 µA
*   I(R32) = -5.076 µA
*   I(R31) = 5.076 µA
*   I(R30) = 325.8 nA
*   I(R29) = 6.562 µA
*   I(R28) = 325.8 nA
*   I(R27) = 6.562 µA
*   I(R26) = 413.1 pA
*   I(R25) = 413.1 pA
*   I(R24) = 413.2 pA
*   I(R23) = 413.2 pA
*   I(R22) = -4.656 pA
*   I(R9) = -4.656 pA
*   I(R7) = -4.656 pA
*   I(R6) = -4.656 pA
*   I(R356) = -3.806 pA
*   I(R355) = -3.806 pA
*   I(R354) = -3.806 pA
*   I(R5) = 1.192 µA
*   I(R4) = 1.192 µA
*   I(R3) = 1.192 µA
*   I(R2) = 1.192 µA
*   I(R1) = 1.192 µA
*   I(R21) = 1 mA
*   I(R20) = 1 mA
*   I(R19) = -1 mA
*   I(R18) = 1.43 nA
*   I(R17) = -1 mA
*   I(R16) = 1 mA
*   I(R15) = 1 mA
*   I(R14) = -1 mA
*   I(R13) = 1.43 nA
*   I(R12) = -1 mA
*   I(V3) = -1.192 µA
*   I(Vdd2) = 45.82 µA
*   I(Voff1) = -2 mA
*   I(V2) = -156.7 mA
*   I(V1) = 158.8 mA
*   I(Vdd1) = -126.3 µA